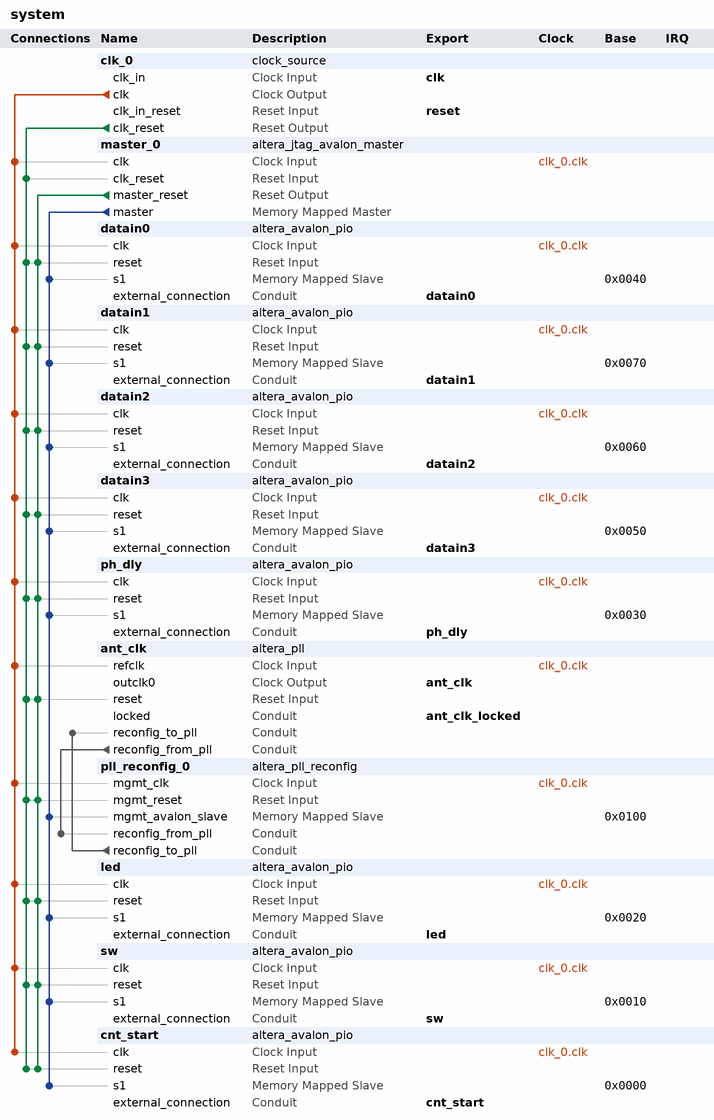
[diagram p0: system contents]
# Platform Designer (Qsys) system system, Cyclone V 5CSEMA4U23C6
# Parameters at their usual value, and those the tool derives, are not listed.
package require -exact qsys 17.1
create_system system
set_project_property DEVICE_FAMILY {Cyclone V}
set_project_property DEVICE 5CSEMA4U23C6

add_instance clk_0 clock_source 17.1
set_instance_parameter_value clk_0 clockFrequency 50000000

add_instance master_0 altera_jtag_avalon_master 17.1

add_instance datain0 altera_avalon_pio 17.1
set_instance_parameter_value datain0 direction Output
set_instance_parameter_value datain0 resetValue 4042312874
set_instance_parameter_value datain0 width 32

add_instance datain1 altera_avalon_pio 17.1
set_instance_parameter_value datain1 direction Output
set_instance_parameter_value datain1 resetValue 4042312874
set_instance_parameter_value datain1 width 32

add_instance datain2 altera_avalon_pio 17.1
set_instance_parameter_value datain2 direction Output
set_instance_parameter_value datain2 resetValue 4042312874
set_instance_parameter_value datain2 width 32

add_instance datain3 altera_avalon_pio 17.1
set_instance_parameter_value datain3 direction Output
set_instance_parameter_value datain3 resetValue 4042312874
set_instance_parameter_value datain3 width 32

add_instance ph_dly altera_avalon_pio 17.1
set_instance_parameter_value ph_dly direction Output
set_instance_parameter_value ph_dly resetValue 4
set_instance_parameter_value ph_dly width 8

add_instance ant_clk altera_pll 17.1
set_instance_parameter_value ant_clk gui_device_speed_grade 1
set_instance_parameter_value ant_clk gui_en_reconf true
set_instance_parameter_value ant_clk gui_number_of_clocks 1
set_instance_parameter_value ant_clk gui_operation_mode direct
set_instance_parameter_value ant_clk gui_output_clock_frequency0 119.104
set_instance_parameter_value ant_clk gui_pll_mode {Fractional-N PLL}
set_instance_parameter_value ant_clk gui_reference_clock_frequency 50.0
set_instance_parameter_value ant_clk gui_use_locked true

add_instance pll_reconfig_0 altera_pll_reconfig 17.1

add_instance led altera_avalon_pio 17.1
set_instance_parameter_value led direction Output
set_instance_parameter_value led width 7

add_instance sw altera_avalon_pio 17.1
set_instance_parameter_value sw direction Input
set_instance_parameter_value sw width 4

add_instance cnt_start altera_avalon_pio 17.1
set_instance_parameter_value cnt_start direction Output
set_instance_parameter_value cnt_start width 1

# connections
add_connection clk_0.clk ant_clk.refclk clock
add_connection clk_0.clk cnt_start.clk clock
add_connection clk_0.clk datain0.clk clock
add_connection clk_0.clk datain1.clk clock
add_connection clk_0.clk datain2.clk clock
add_connection clk_0.clk datain3.clk clock
add_connection clk_0.clk led.clk clock
add_connection clk_0.clk master_0.clk clock
add_connection clk_0.clk ph_dly.clk clock
add_connection clk_0.clk pll_reconfig_0.mgmt_clk clock
add_connection clk_0.clk sw.clk clock
add_connection clk_0.clk_reset ant_clk.reset reset
add_connection clk_0.clk_reset cnt_start.reset reset
add_connection clk_0.clk_reset datain0.reset reset
add_connection clk_0.clk_reset datain1.reset reset
add_connection clk_0.clk_reset datain2.reset reset
add_connection clk_0.clk_reset datain3.reset reset
add_connection clk_0.clk_reset led.reset reset
add_connection clk_0.clk_reset master_0.clk_reset reset
add_connection clk_0.clk_reset ph_dly.reset reset
add_connection clk_0.clk_reset pll_reconfig_0.mgmt_reset reset
add_connection clk_0.clk_reset sw.reset reset
add_connection master_0.master_reset ant_clk.reset reset
add_connection master_0.master_reset cnt_start.reset reset
add_connection master_0.master_reset datain0.reset reset
add_connection master_0.master_reset datain1.reset reset
add_connection master_0.master_reset datain2.reset reset
add_connection master_0.master_reset datain3.reset reset
add_connection master_0.master_reset led.reset reset
add_connection master_0.master_reset ph_dly.reset reset
add_connection master_0.master_reset pll_reconfig_0.mgmt_reset reset
add_connection master_0.master_reset sw.reset reset
add_connection master_0.master cnt_start.s1 avalon
set_connection_parameter_value master_0.master/cnt_start.s1 baseAddress 0x0000
add_connection master_0.master datain0.s1 avalon
set_connection_parameter_value master_0.master/datain0.s1 baseAddress 0x0040
add_connection master_0.master datain1.s1 avalon
set_connection_parameter_value master_0.master/datain1.s1 baseAddress 0x0070
add_connection master_0.master datain2.s1 avalon
set_connection_parameter_value master_0.master/datain2.s1 baseAddress 0x0060
add_connection master_0.master datain3.s1 avalon
set_connection_parameter_value master_0.master/datain3.s1 baseAddress 0x0050
add_connection master_0.master led.s1 avalon
set_connection_parameter_value master_0.master/led.s1 baseAddress 0x0020
add_connection master_0.master ph_dly.s1 avalon
set_connection_parameter_value master_0.master/ph_dly.s1 baseAddress 0x0030
add_connection master_0.master pll_reconfig_0.mgmt_avalon_slave avalon
set_connection_parameter_value master_0.master/pll_reconfig_0.mgmt_avalon_slave baseAddress 0x0100
add_connection master_0.master sw.s1 avalon
set_connection_parameter_value master_0.master/sw.s1 baseAddress 0x0010
add_connection ant_clk.reconfig_from_pll pll_reconfig_0.reconfig_from_pll conduit
add_connection pll_reconfig_0.reconfig_to_pll ant_clk.reconfig_to_pll conduit

# exported interfaces
add_interface ant_clk clock source
set_interface_property ant_clk EXPORT_OF ant_clk.outclk0
add_interface ant_clk_locked conduit end
set_interface_property ant_clk_locked EXPORT_OF ant_clk.locked
add_interface clk clock sink
set_interface_property clk EXPORT_OF clk_0.clk_in
add_interface cnt_start conduit end
set_interface_property cnt_start EXPORT_OF cnt_start.external_connection
add_interface datain0 conduit end
set_interface_property datain0 EXPORT_OF datain0.external_connection
add_interface datain1 conduit end
set_interface_property datain1 EXPORT_OF datain1.external_connection
add_interface datain2 conduit end
set_interface_property datain2 EXPORT_OF datain2.external_connection
add_interface datain3 conduit end
set_interface_property datain3 EXPORT_OF datain3.external_connection
add_interface led conduit end
set_interface_property led EXPORT_OF led.external_connection
add_interface ph_dly conduit end
set_interface_property ph_dly EXPORT_OF ph_dly.external_connection
add_interface reset reset sink
set_interface_property reset EXPORT_OF clk_0.clk_in_reset
add_interface sw conduit end
set_interface_property sw EXPORT_OF sw.external_connection

set_interconnect_requirement {$system} qsys_mm.clockCrossingAdapter HANDSHAKE
set_interconnect_requirement {$system} qsys_mm.enableEccProtection FALSE
set_interconnect_requirement {$system} qsys_mm.insertDefaultSlave FALSE
set_interconnect_requirement {$system} qsys_mm.maxAdditionalLatency 1

save_system system.qsys
